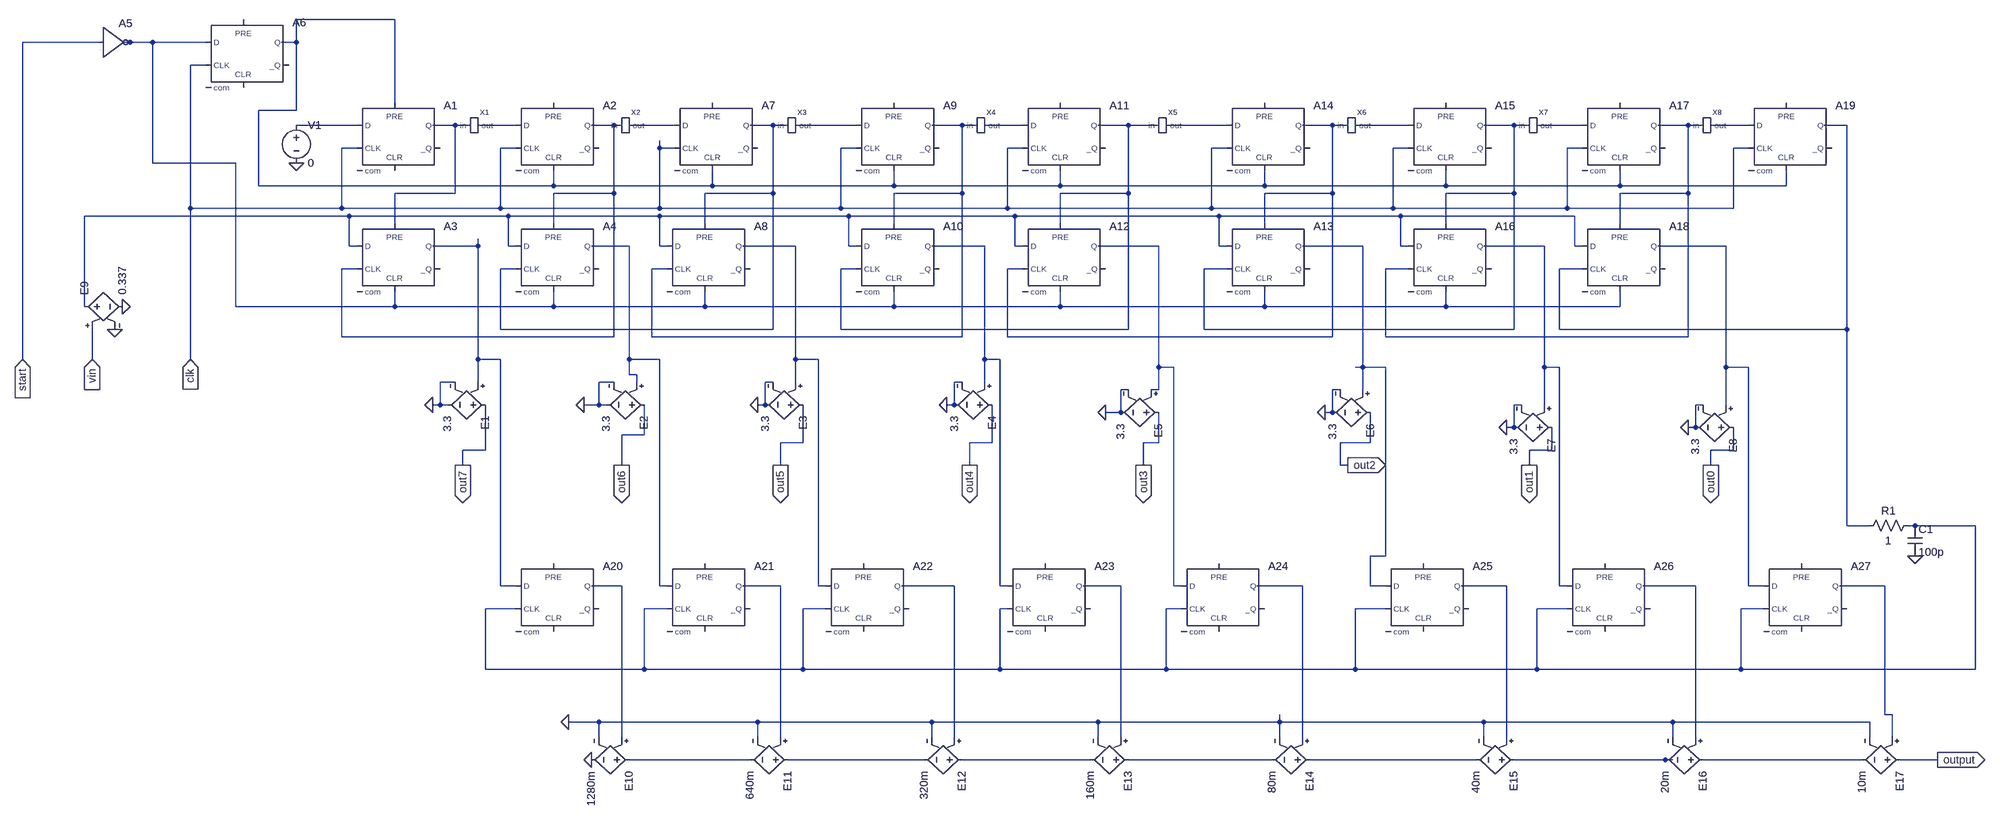
[diagram p0: schematic sar_new.asc]
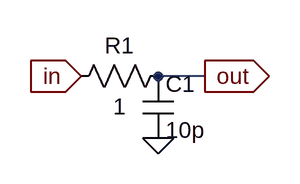
[diagram p1: sub-circuit rc_delay.asc]
sar_new.asc, the LTspice schematic file:
Version 4
SHEET 1 2616 1432
WIRE -784 -240 -992 -240
WIRE -1408 -192 -1616 -192
WIRE -1344 -192 -1360 -192
WIRE -1296 -192 -1344 -192
WIRE -1184 -192 -1296 -192
WIRE -992 -192 -992 -240
WIRE -992 -192 -1024 -192
WIRE -1184 -144 -1216 -144
WIRE -784 -64 -784 -240
WIRE -992 -48 -992 -192
WIRE -992 -48 -1072 -48
WIRE -864 -16 -992 -16
WIRE -656 -16 -704 -16
WIRE -624 -16 -656 -16
WIRE -528 -16 -608 -16
WIRE -320 -16 -368 -16
WIRE -304 -16 -320 -16
WIRE -192 -16 -288 -16
WIRE 16 -16 -32 -16
WIRE 48 -16 16 -16
WIRE 192 -16 64 -16
WIRE 416 -16 352 -16
WIRE 448 -16 416 -16
WIRE 544 -16 464 -16
WIRE 768 -16 704 -16
WIRE 832 -16 768 -16
WIRE 976 -16 848 -16
WIRE 1200 -16 1136 -16
WIRE 1232 -16 1200 -16
WIRE 1360 -16 1248 -16
WIRE 1584 -16 1520 -16
WIRE 1616 -16 1584 -16
WIRE 1728 -16 1632 -16
WIRE 1952 -16 1888 -16
WIRE 1984 -16 1952 -16
WIRE 2080 -16 2000 -16
WIRE 2288 -16 2240 -16
WIRE -864 32 -896 32
WIRE -528 32 -560 32
WIRE -224 32 -224 16
WIRE -192 32 -224 32
WIRE 192 32 160 32
WIRE 544 32 512 32
WIRE 976 32 944 32
WIRE 1360 32 1328 32
WIRE 1728 32 1696 32
WIRE 2080 32 2048 32
WIRE -1296 64 -1296 -192
WIRE -1120 64 -1296 64
WIRE -1072 112 -1072 -48
WIRE -448 112 -448 80
WIRE -448 112 -1072 112
WIRE -112 112 -112 80
WIRE -112 112 -448 112
WIRE 272 112 272 80
WIRE 272 112 -112 112
WIRE 624 112 624 80
WIRE 624 112 272 112
WIRE 1056 112 1056 80
WIRE 1056 112 624 112
WIRE 1440 112 1440 80
WIRE 1440 112 1056 112
WIRE 1808 112 1808 80
WIRE 1808 112 1440 112
WIRE 2160 112 2160 80
WIRE 2160 112 1808 112
WIRE -656 128 -656 -16
WIRE -656 128 -784 128
WIRE -320 128 -320 -16
WIRE -320 128 -448 128
WIRE 16 128 16 -16
WIRE 16 128 -128 128
WIRE 416 128 416 -16
WIRE 416 128 272 128
WIRE 768 128 768 -16
WIRE 768 128 624 128
WIRE 1200 128 1200 -16
WIRE 1200 128 1056 128
WIRE 1584 128 1584 -16
WIRE 1584 128 1440 128
WIRE 1952 128 1952 -16
WIRE 1952 128 1808 128
WIRE -1216 160 -1216 -144
WIRE -896 160 -896 32
WIRE -896 160 -1216 160
WIRE -560 160 -560 32
WIRE -560 160 -896 160
WIRE -224 160 -224 32
WIRE -224 160 -560 160
WIRE 160 160 160 32
WIRE 160 160 -224 160
WIRE 512 160 512 32
WIRE 512 160 160 160
WIRE 944 160 944 32
WIRE 944 160 512 160
WIRE 1328 160 1328 32
WIRE 1328 160 944 160
WIRE 1696 160 1696 32
WIRE 1696 160 1328 160
WIRE 2048 160 2048 32
WIRE 2048 160 1696 160
WIRE -880 176 -1440 176
WIRE -544 176 -880 176
WIRE -224 176 -544 176
WIRE 176 176 -224 176
WIRE 528 176 176 176
WIRE 960 176 528 176
WIRE 1344 176 960 176
WIRE 1712 176 1344 176
WIRE -784 192 -784 128
WIRE -448 192 -448 128
WIRE -128 192 -128 128
WIRE 272 192 272 128
WIRE 624 192 624 128
WIRE 1056 192 1056 128
WIRE 1440 192 1440 128
WIRE 1808 192 1808 128
WIRE -880 240 -880 176
WIRE -864 240 -880 240
WIRE -608 240 -608 224
WIRE -608 240 -704 240
WIRE -544 240 -544 176
WIRE -528 240 -544 240
WIRE -288 240 -368 240
WIRE -224 240 -224 176
WIRE -208 240 -224 240
WIRE 64 240 -48 240
WIRE 176 240 176 176
WIRE 192 240 176 240
WIRE 464 240 352 240
WIRE 528 240 528 176
WIRE 544 240 528 240
WIRE 832 240 704 240
WIRE 960 240 960 176
WIRE 976 240 960 240
WIRE 1264 240 1136 240
WIRE 1344 240 1344 176
WIRE 1360 240 1344 240
WIRE 1648 240 1520 240
WIRE 1712 240 1712 176
WIRE 1728 240 1712 240
WIRE 2032 240 1888 240
WIRE -864 288 -896 288
WIRE -528 288 -560 288
WIRE -208 288 -240 288
WIRE 192 288 160 288
WIRE 544 288 512 288
WIRE 976 288 928 288
WIRE 1360 288 1312 288
WIRE 1728 288 1680 288
WIRE -1440 368 -1440 176
WIRE -1120 368 -1120 64
WIRE -784 368 -784 336
WIRE -784 368 -1120 368
WIRE -448 368 -448 336
WIRE -448 368 -784 368
WIRE -128 368 -128 336
WIRE -128 368 -448 368
WIRE 272 368 272 336
WIRE 272 368 -128 368
WIRE 624 368 624 336
WIRE 624 368 272 368
WIRE 1056 368 1056 336
WIRE 1056 368 624 368
WIRE 1440 368 1440 336
WIRE 1440 368 1056 368
WIRE 1808 368 1808 336
WIRE 1808 368 1440 368
WIRE -560 416 -560 288
WIRE 16 416 16 128
WIRE 16 416 -560 416
WIRE 160 416 160 288
WIRE 768 416 768 128
WIRE 768 416 160 416
WIRE 928 416 928 288
WIRE 1584 416 1584 128
WIRE 1584 416 928 416
WIRE 1680 416 1680 288
WIRE 2288 416 2288 -16
WIRE 2288 416 1680 416
WIRE -896 432 -896 288
WIRE -320 432 -320 128
WIRE -320 432 -896 432
WIRE -240 432 -240 288
WIRE 416 432 416 128
WIRE 416 432 -240 432
WIRE 512 432 512 288
WIRE 1200 432 1200 128
WIRE 1200 432 512 432
WIRE 1312 432 1312 288
WIRE 1952 432 1952 128
WIRE 1952 432 1312 432
WIRE -1616 480 -1616 -192
WIRE -1424 480 -1424 416
WIRE -1216 480 -1216 160
WIRE -608 480 -608 240
WIRE -560 480 -608 480
WIRE -288 480 -288 240
WIRE -224 480 -288 480
WIRE 64 480 64 240
WIRE 112 480 64 480
WIRE 464 480 464 240
WIRE 496 480 464 480
WIRE 832 496 832 240
WIRE 864 496 832 496
WIRE 1264 496 1264 240
WIRE 1264 496 1248 496
WIRE 1312 496 1264 496
WIRE 1648 496 1648 240
WIRE 1680 496 1648 496
WIRE 2032 496 2032 240
WIRE 2080 496 2032 496
WIRE -288 512 -288 480
WIRE -272 512 -288 512
WIRE -656 528 -688 528
WIRE -608 528 -608 480
WIRE -320 528 -352 528
WIRE -272 528 -272 512
WIRE 16 528 0 528
WIRE 64 528 64 480
WIRE 416 528 400 528
WIRE 464 528 464 480
WIRE 768 544 752 544
WIRE 832 544 832 496
WIRE 832 544 816 544
WIRE 1216 544 1200 544
WIRE 1264 544 1264 496
WIRE -688 576 -688 528
WIRE -688 576 -704 576
WIRE -672 576 -688 576
WIRE -352 576 -352 528
WIRE -352 576 -384 576
WIRE -336 576 -352 576
WIRE 0 576 0 528
WIRE 0 576 -16 576
WIRE 400 576 400 528
WIRE 400 576 384 576
WIRE 1600 576 1584 576
WIRE 1648 576 1648 496
WIRE 1984 576 1968 576
WIRE 2032 576 2032 496
WIRE 752 592 752 544
WIRE 752 592 720 592
WIRE 1200 592 1200 544
WIRE 1200 592 1184 592
WIRE 1584 624 1584 576
WIRE 1584 624 1568 624
WIRE 1968 624 1968 576
WIRE 1968 624 1952 624
WIRE -256 640 -256 576
WIRE -256 640 -304 640
WIRE 80 656 80 576
WIRE 80 656 32 656
WIRE 480 656 480 576
WIRE 480 656 432 656
WIRE 832 656 832 592
WIRE 832 656 800 656
WIRE 1280 656 1280 592
WIRE 1280 656 1216 656
WIRE -592 672 -592 576
WIRE -592 672 -640 672
WIRE 1664 672 1664 624
WIRE 1664 672 1616 672
WIRE 2048 672 2048 624
WIRE 2048 672 2000 672
WIRE -640 704 -640 672
WIRE -304 704 -304 640
WIRE 32 704 32 656
WIRE 432 704 432 656
WIRE 800 704 800 656
WIRE 1216 704 1216 656
WIRE 1232 704 1216 704
WIRE 1616 704 1616 672
WIRE 2000 704 2000 672
WIRE 2288 832 2288 416
WIRE 2336 832 2288 832
WIRE 2432 832 2416 832
WIRE 2560 832 2432 832
WIRE 1312 896 1312 496
WIRE 1312 896 1280 896
WIRE -560 960 -560 480
WIRE -528 960 -560 960
WIRE -304 960 -368 960
WIRE -224 960 -224 480
WIRE -208 960 -224 960
WIRE 32 960 -48 960
WIRE 112 960 112 480
WIRE 128 960 112 960
WIRE 400 960 288 960
WIRE 496 960 496 480
WIRE 512 960 496 960
WIRE 752 960 672 960
WIRE 864 960 864 496
WIRE 880 960 864 960
WIRE 1136 960 1040 960
WIRE 1280 960 1280 896
WIRE 1312 960 1280 960
WIRE 1568 960 1472 960
WIRE 1680 960 1680 496
WIRE 1696 960 1680 960
WIRE 1968 960 1856 960
WIRE 2080 960 2080 496
WIRE 2112 960 2080 960
WIRE 2368 960 2272 960
WIRE -528 1008 -592 1008
WIRE -208 1008 -256 1008
WIRE 128 1008 80 1008
WIRE 512 1008 496 1008
WIRE 880 1008 848 1008
WIRE 1312 1008 1248 1008
WIRE 1696 1008 1632 1008
WIRE 2112 1008 2064 1008
WIRE -592 1136 -592 1008
WIRE -256 1136 -256 1008
WIRE -256 1136 -592 1136
WIRE 80 1136 80 1008
WIRE 80 1136 -256 1136
WIRE 496 1136 496 1008
WIRE 496 1136 80 1136
WIRE 848 1136 848 1008
WIRE 848 1136 496 1136
WIRE 1248 1136 1248 1008
WIRE 1248 1136 848 1136
WIRE 1632 1136 1632 1008
WIRE 1632 1136 1248 1136
WIRE 2064 1136 2064 1008
WIRE 2064 1136 1632 1136
WIRE 2560 1136 2560 832
WIRE 2560 1136 2064 1136
WIRE 2368 1232 2368 960
WIRE 2384 1232 2368 1232
WIRE -352 1248 -416 1248
WIRE -16 1248 -352 1248
WIRE 352 1248 -16 1248
WIRE 704 1248 352 1248
WIRE 1088 1248 1088 1232
WIRE 1088 1248 704 1248
WIRE 1520 1248 1088 1248
WIRE 1920 1248 1520 1248
WIRE 2336 1248 1920 1248
WIRE -352 1280 -352 1248
WIRE -304 1280 -304 960
WIRE -16 1280 -16 1248
WIRE 32 1280 32 960
WIRE 352 1280 352 1248
WIRE 400 1280 400 960
WIRE 704 1280 704 1248
WIRE 752 1280 752 960
WIRE 1088 1280 1088 1248
WIRE 1136 1280 1136 960
WIRE 1520 1280 1520 1248
WIRE 1568 1280 1568 960
WIRE 1920 1280 1920 1248
WIRE 1968 1280 1968 960
WIRE 2336 1280 2336 1248
WIRE 2384 1280 2384 1232
WIRE -32 1328 -288 1328
WIRE 336 1328 48 1328
WIRE 688 1328 416 1328
WIRE 1072 1328 768 1328
WIRE 1504 1328 1152 1328
WIRE 1904 1328 1584 1328
WIRE 1920 1328 1904 1328
WIRE 2320 1328 1984 1328
WIRE 2480 1328 2400 1328
FLAG -992 64 0
FLAG 2000 704 out0
IOPIN 2000 704 Out
FLAG 1616 704 out1
IOPIN 1616 704 Out
FLAG 1232 704 out2
IOPIN 1232 704 Out
FLAG 800 704 out3
IOPIN 800 704 Out
FLAG 432 704 out4
IOPIN 432 704 Out
FLAG 32 704 out5
IOPIN 32 704 Out
FLAG -304 704 out6
IOPIN -304 704 Out
FLAG -640 704 out7
IOPIN -640 704 Out
FLAG 1952 624 0
FLAG 1568 624 0
FLAG 1184 592 0
FLAG 384 576 0
FLAG 720 592 0
FLAG -1616 480 start
IOPIN -1616 480 In
FLAG -1424 480 vin
IOPIN -1424 480 In
FLAG -1216 480 clk
IOPIN -1216 480 In
FLAG -1376 416 0
FLAG -1360 368 0
FLAG -416 1248 0
FLAG -368 1328 0
FLAG 2432 896 0
FLAG 2480 1328 output
IOPIN 2480 1328 Out
FLAG -704 576 0
FLAG -384 576 0
FLAG -16 576 0
SYMBOL Digital\\dflop -784 -64 R0
SYMATTR InstName A1
SYMBOL Digital\\dflop -448 -64 R0
SYMATTR InstName A2
SYMBOL Digital\\dflop -784 192 R0
SYMATTR InstName A3
SYMBOL Digital\\dflop -448 192 R0
SYMATTR InstName A4
SYMBOL voltage -992 -32 R0
WINDOW 123 0 0 Left 0
WINDOW 39 0 0 Left 0
SYMATTR InstName V1
SYMATTR Value 0
SYMBOL Digital\\inv -1408 -256 R0
SYMATTR InstName A5
SYMBOL Digital\\dflop -1104 -240 R0
SYMATTR InstName A6
SYMBOL rc_delay -624 -32 R0
SYMATTR InstName X1
SYMBOL Digital\\dflop -112 -64 R0
SYMATTR InstName A7
SYMBOL rc_delay -304 -32 R0
SYMATTR InstName X2
SYMBOL Digital\\dflop -128 192 R0
SYMATTR InstName A8
SYMBOL Digital\\dflop 272 -64 R0
SYMATTR InstName A9
SYMBOL Digital\\dflop 272 192 R0
SYMATTR InstName A10
SYMBOL Digital\\dflop 624 -64 R0
SYMATTR InstName A11
SYMBOL rc_delay 48 -32 R0
SYMATTR InstName X3
SYMBOL rc_delay 448 -32 R0
SYMATTR InstName X4
SYMBOL Digital\\dflop 624 192 R0
SYMATTR InstName A12
SYMBOL Digital\\dflop 1056 192 R0
SYMATTR InstName A13
SYMBOL Digital\\dflop 1056 -64 R0
SYMATTR InstName A14
SYMBOL Digital\\dflop 1440 -64 R0
SYMATTR InstName A15
SYMBOL Digital\\dflop 1440 192 R0
SYMATTR InstName A16
SYMBOL Digital\\dflop 1808 -64 R0
SYMATTR InstName A17
SYMBOL Digital\\dflop 1808 192 R0
SYMATTR InstName A18
SYMBOL Digital\\dflop 2160 -64 R0
SYMATTR InstName A19
SYMBOL rc_delay 832 -32 R0
SYMATTR InstName X5
SYMBOL rc_delay 1232 -32 R0
SYMATTR InstName X6
SYMBOL rc_delay 1616 -32 R0
SYMATTR InstName X7
SYMBOL rc_delay 1984 -32 R0
SYMATTR InstName X8
SYMBOL e -576 576 R90
SYMATTR InstName E1
SYMATTR Value 3.3
SYMBOL e -240 576 R90
SYMATTR InstName E2
SYMATTR Value 3.3
SYMBOL e 96 576 R90
SYMATTR InstName E3
SYMATTR Value 3.3
SYMBOL e 496 576 R90
SYMATTR InstName E4
SYMATTR Value 3.3
SYMBOL e 848 592 R90
SYMATTR InstName E5
SYMATTR Value 3.3
SYMBOL e 1296 592 R90
SYMATTR InstName E6
SYMATTR Value 3.3
SYMBOL e 1680 624 R90
SYMATTR InstName E7
SYMATTR Value 3.3
SYMBOL e 2064 624 R90
SYMATTR InstName E8
SYMATTR Value 3.3
SYMBOL e -1456 368 R270
SYMATTR InstName E9
SYMATTR Value 0.337
SYMBOL Digital\\dflop -448 912 R0
SYMATTR InstName A20
SYMBOL Digital\\dflop -128 912 R0
SYMATTR InstName A21
SYMBOL Digital\\dflop 208 912 R0
SYMATTR InstName A22
SYMBOL Digital\\dflop 592 912 R0
SYMATTR InstName A23
SYMBOL Digital\\dflop 960 912 R0
SYMATTR InstName A24
SYMBOL Digital\\dflop 1392 912 R0
SYMATTR InstName A25
SYMBOL Digital\\dflop 1776 912 R0
SYMATTR InstName A26
SYMBOL Digital\\dflop 2192 912 R0
SYMATTR InstName A27
SYMBOL e -272 1328 R90
SYMATTR InstName E10
SYMATTR Value 1280m
SYMBOL e 64 1328 R90
SYMATTR InstName E11
SYMATTR Value 640m
SYMBOL e 432 1328 R90
SYMATTR InstName E12
SYMATTR Value 320m
SYMBOL e 784 1328 R90
SYMATTR InstName E13
SYMATTR Value 160m
SYMBOL e 1168 1328 R90
SYMATTR InstName E14
SYMATTR Value 80m
SYMBOL e 1600 1328 R90
SYMATTR InstName E15
SYMATTR Value 40m
SYMBOL e 2000 1328 R90
SYMATTR InstName E16
SYMATTR Value 20m
SYMBOL e 2416 1328 R90
SYMATTR InstName E17
SYMATTR Value 10m
SYMBOL res 2432 816 R90
WINDOW 0 0 56 VBottom 2
WINDOW 3 32 56 VTop 2
SYMATTR InstName R1
SYMATTR Value 1
SYMBOL cap 2416 832 R0
SYMATTR InstName C1
SYMATTR Value 100p

rc_delay.asc, the sub-circuit schematic file:
Version 4
SHEET 1 880 680
WIRE 272 160 224 160
FLAG 144 160 in
IOPIN 144 160 In
FLAG 272 160 out
IOPIN 272 160 Out
FLAG 224 224 0
SYMBOL res 240 144 R90
WINDOW 0 0 56 VBottom 2
WINDOW 3 32 56 VTop 2
SYMATTR InstName R1
SYMATTR Value 1
SYMBOL cap 208 160 R0
SYMATTR InstName C1
SYMATTR Value 10p

The netlist it stands for:
* sar_new.asc
A1 N003 0 clk N001 0 0 N004 0 DFLOP
A2 N005 0 clk 0 N001 0 N006 0 DFLOP
A3 N021 0 N006 N004 N002 0 N022 0 DFLOP
A4 N021 0 N008 N006 N002 0 N023 0 DFLOP
V1 N003 0 0
A5 start 0 0 0 0 N002 0 0 BUF
A6 N002 0 clk 0 0 0 N001 0 DFLOP
XX1 N004 N005 rc_delay
A7 N007 0 clk 0 N001 0 N008 0 DFLOP
XX2 N006 N007 rc_delay
A8 N021 0 N010 N008 N002 0 N024 0 DFLOP
A9 N009 0 clk 0 N001 0 N010 0 DFLOP
A10 N021 0 N012 N010 N002 0 N025 0 DFLOP
A11 N011 0 clk 0 N001 0 N012 0 DFLOP
XX3 N008 N009 rc_delay
XX4 N010 N011 rc_delay
A12 N021 0 N014 N012 N002 0 N026 0 DFLOP
A13 N021 0 N016 N014 N002 0 N027 0 DFLOP
A14 N013 0 clk 0 N001 0 N014 0 DFLOP
A15 N015 0 clk 0 N001 0 N016 0 DFLOP
A16 N021 0 N018 N016 N002 0 N028 0 DFLOP
A17 N017 0 clk 0 N001 0 N018 0 DFLOP
A18 N021 0 N020 N018 N002 0 N029 0 DFLOP
A19 N019 0 clk 0 N001 0 N020 0 DFLOP
XX5 N012 N013 rc_delay
XX6 N014 N015 rc_delay
XX7 N016 N017 rc_delay
XX8 N018 N019 rc_delay
E1 out7 0 N022 0 3.3
E2 out6 0 N023 0 3.3
E3 out5 0 N024 0 3.3
E4 out4 0 N025 0 3.3
E5 out3 0 N026 0 3.3
E6 out2 0 N027 0 3.3
E7 out1 0 N028 0 3.3
E8 out0 0 N029 0 3.3
E9 N021 0 vin 0 0.337
A20 N022 0 N030 0 0 0 N031 0 DFLOP
A21 N023 0 N030 0 0 0 N032 0 DFLOP
A22 N024 0 N030 0 0 0 N033 0 DFLOP
A23 N025 0 N030 0 0 0 N034 0 DFLOP
A24 N026 0 N030 0 0 0 N035 0 DFLOP
A25 N027 0 N030 0 0 0 N036 0 DFLOP
A26 N028 0 N030 0 0 0 N037 0 DFLOP
A27 N029 0 N030 0 0 0 N038 0 DFLOP
E10 N039 0 N031 0 1280m
E11 N040 N039 N032 0 640m
E12 N041 N040 N033 0 320m
E13 N042 N041 N034 0 160m
E14 N043 N042 N035 0 80m
E15 N044 N043 N036 0 40m
E16 N045 N044 N037 0 20m
E17 output N045 N038 0 10m
R1 N030 N020 1
C1 N030 0 100p

* block symbol definitions
.subckt rc_delay in out
R1 out in 1
C1 out 0 10p
.ends rc_delay

.backanno
.end